# Altium schematic sheet 4_SurvBot_RCU_Bluetooth.SchDoc
size A2; SheetNumber: 5; SheetTotal: 8
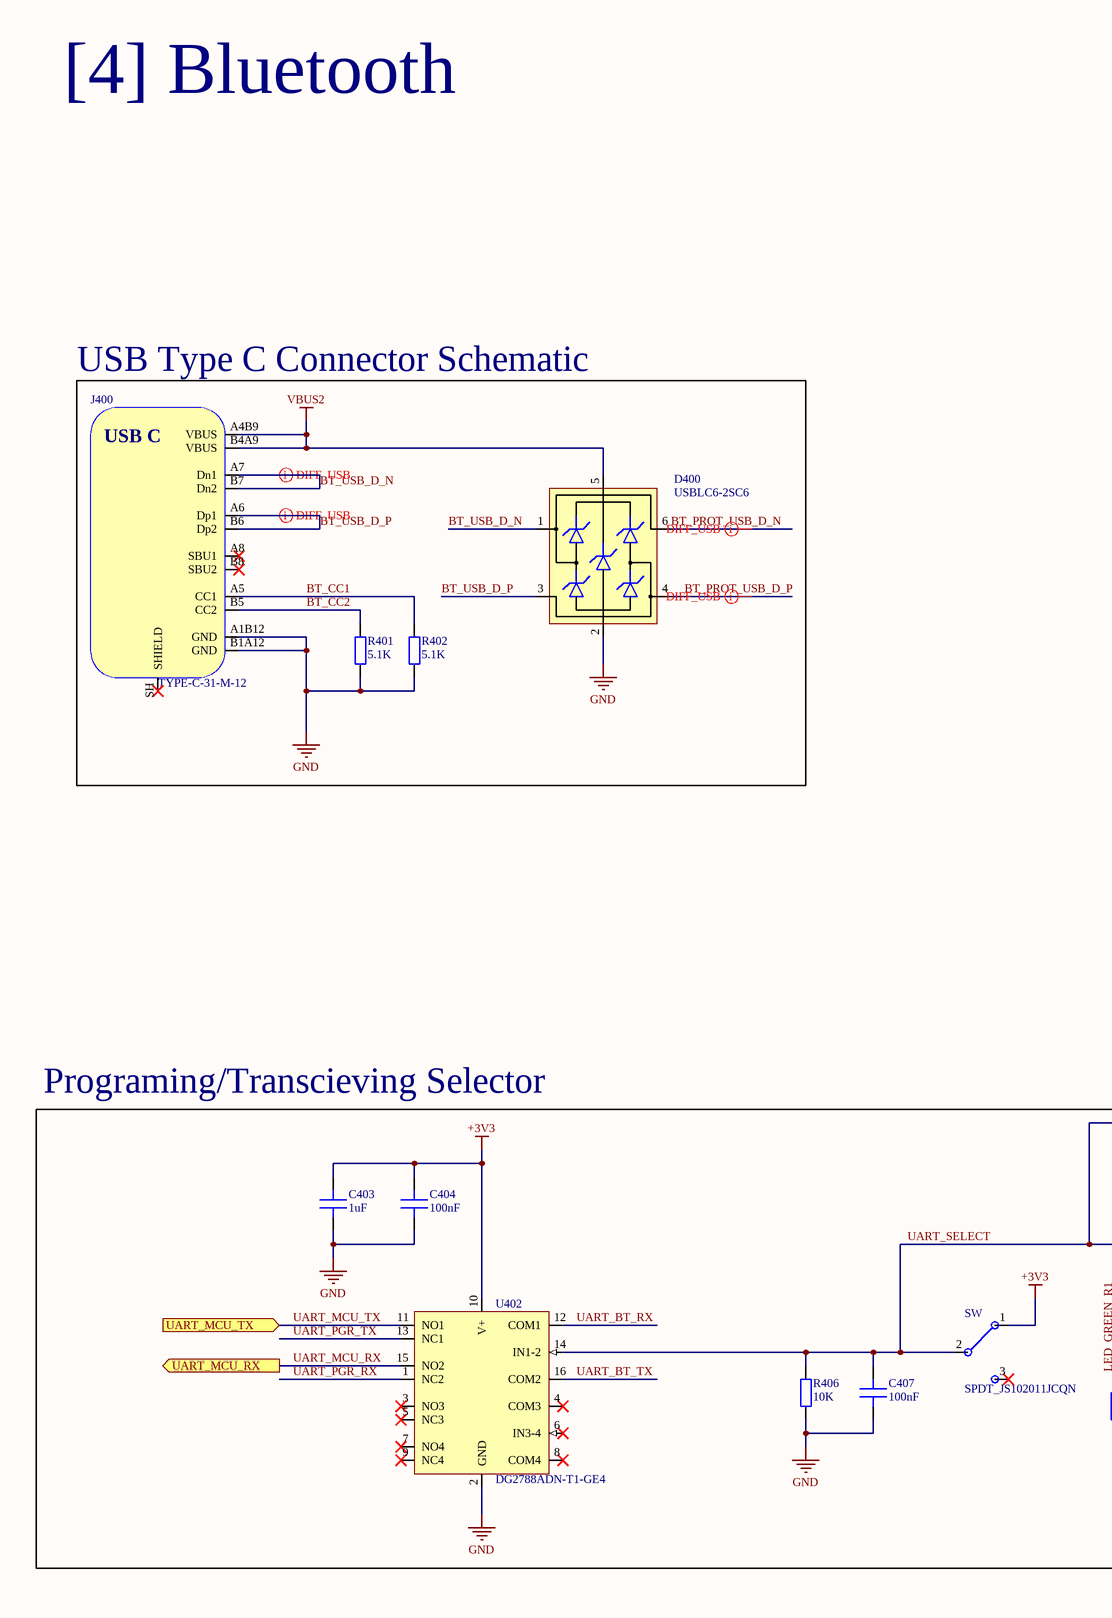
[diagram p0: 4_SurvBot_RCU_Bluetooth.SchDoc, left]
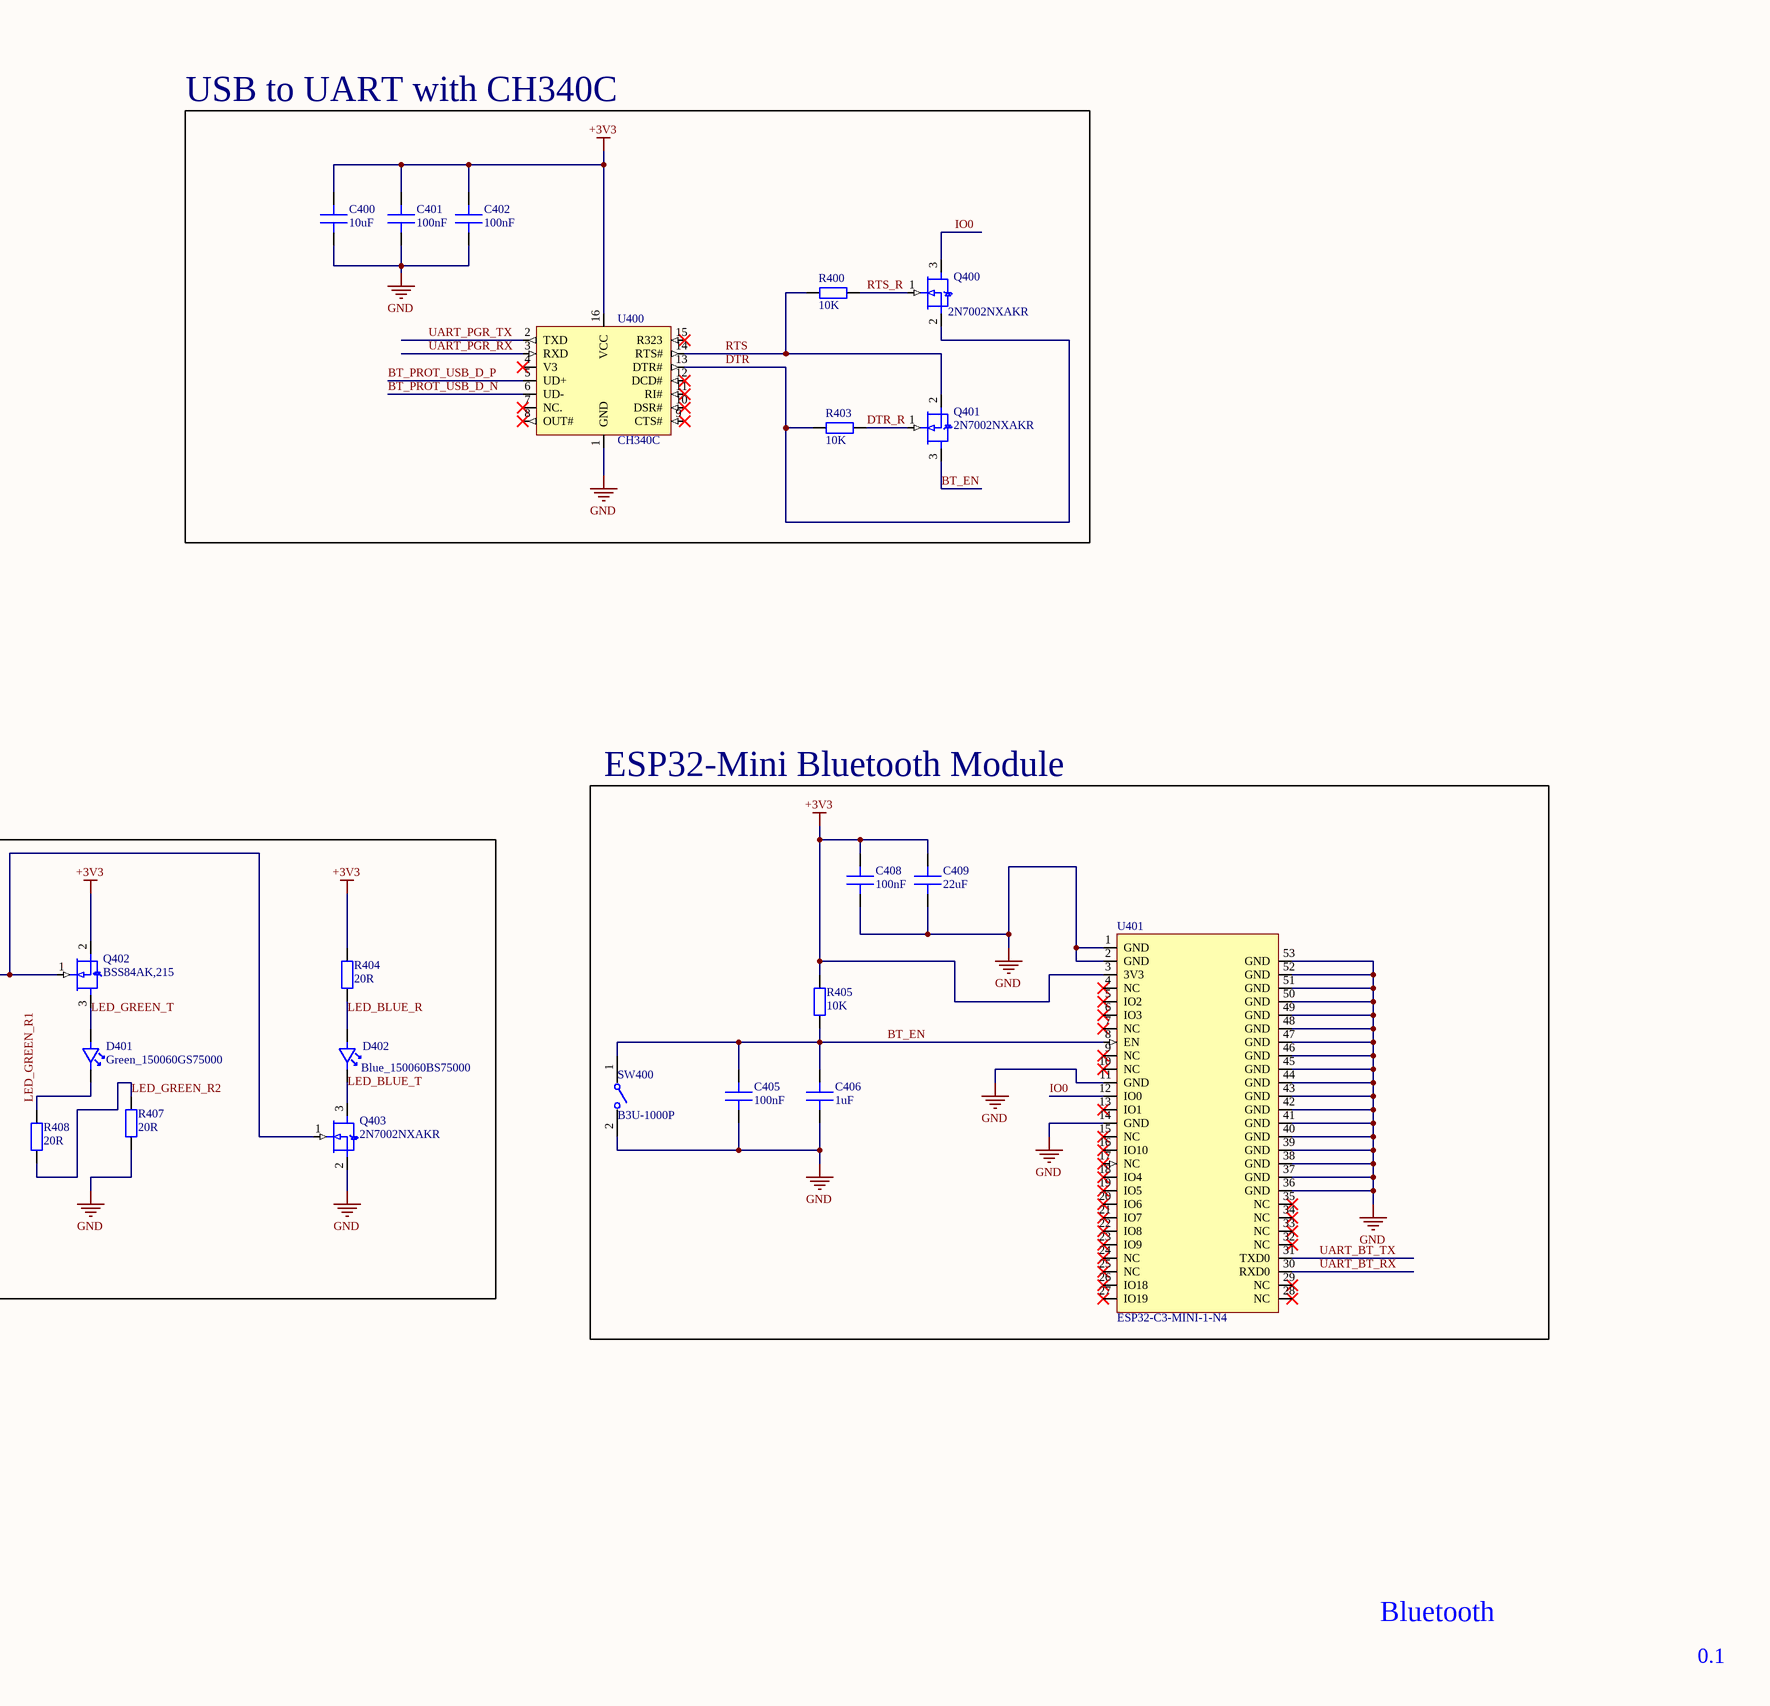
[diagram p1: 4_SurvBot_RCU_Bluetooth.SchDoc, right]

## Parts
C400  10uF  [CAP_0603]
C401  100nF  [CAP_0603]
C402  100nF  [CAP_0603]
C403  1uF  [CAP_0603]
C404  100nF  [CAP_0603]
C405  100nF  [CAP_0603]
C406  1uF  [CAP_0603]
C407  100nF  [CAP_0603]
C408  100nF  [CAP_0603]
C409  22uF  [CAP_0603]
D400  USBLC6-2SC6  [SOT-23-6]
D401  Green_150060GS75000  [LED_0603]
D402  Blue_150060BS75000  [LED_0603]
J400  TYPE-C-31-M-12  [USB4105-GF-A-060]
Q400  2N7002NXAKR  [SOT23-3]
Q401  2N7002NXAKR  [SOT23-3]
Q402  BSS84AK,215  [SOT23-3]
Q403  2N7002NXAKR  [SOT23-3]
R400  10K  [RES_0603]
R401  5.1K  [RES_0603]
R402  5.1K  [RES_0603]
R403  10K  [RES_0603]
R404  20R  [RES_0603]
R405  10K  [RES_0603]
R406  10K  [RES_0603]
R407  20R  [RES_0603]
R408  20R  [RES_0603]
SW  SPDT_JS102011JCQN  [SPDT_Slide-JS102011JCQN]
SW400  B3U-1000P  [FP-B3U-1000P-MFG]
U400  CH340C  [SOP-16]
U401  ESP32-C3-MINI-1-N4  [ESP32­C3­MINI­1]
U402  DG2788ADN-T1-GE4  [UQFN-16-DG2788ADN-T1-GE4]

## Blocks framed on the sheet
USB Type C Connector Schematic: D400 J400 R401 R402
USB to UART with CH340C: C400-C402 Q400 Q401 R400 R403 U400
ESP32-Mini Bluetooth Module: C405 C406 C408 C409 R405 SW400 U401
Programing/Transcieving Selector: C403 C404 C407 D401 D402 Q402 Q403 R404 R406-R408 SW U402

## Ports
UART_MCU_RX (out, see 0_SurvBot_RCU_Overview[1C], 2_SurvBot_RCU_MCU[4B]), UART_MCU_TX (in, see 0_SurvBot_RCU_Overview[1C], 2_SurvBot_RCU_MCU[4B])

## Nets
+3V3: C400.2 C401.2 C402.2 C403.2 C404.2 C408.2 C409.2 Q402.2(S) R404.1 R405.2 SW.1 U400.16(VCC) U401.3(3V3) U402.10(V+)
GND: C400.1 C401.1 C402.1 C403.1 C404.1 C405.1 C406.1 C407.1 C408.1 C409.1 D400.2(GND) J400.A1B12(GND) J400.B1A12(GND) Q403.2(S) R401.1 R402.1 R406.1 R407.1 SW400.2 U400.1(GND) U401.1(GND) U401.2(GND) U401.11(GND) U401.14(GND) U401.36(GND) U401.37(GND) U401.38(GND) U401.39(GND) U401.40(GND) U401.41(GND) U401.42(GND) U401.43(GND) U401.44(GND) U401.45(GND) U401.46(GND) U401.47(GND) U401.48(GND) U401.49(GND) U401.50(GND) U401.51(GND) U401.52(GND) U401.53(GND) U402.2(GND)
VBUS2: D400.5(VBUS) J400.A4B9(VBUS) J400.B4A9(VBUS)
BT_CC1: J400.A5(CC1) R402.2
BT_CC2: J400.B5(CC2) R401.2
BT_EN: C405.2 C406.2 Q401.3(D) R405.1 SW400.1 U401.8(EN)
BT_PROT_USB_D_N: D400.6(IO1) U400.6(UD-)
BT_PROT_USB_D_P: D400.4(IO2) U400.5(UD+)
BT_USB_D_N: D400.1(IO1) J400.A7(Dn1) J400.B7(Dn2)
BT_USB_D_P: D400.3(IO2) J400.A6(Dp1) J400.B6(Dp2)
DTR: Q400.2(S) R403.1 U400.13(DTR#)
DTR_R: Q401.1(G) R403.2
IO0: Q400.3(D) U401.12(IO0)
LED_BLUE_R: D402.2 R404.2
LED_BLUE_T: D402.1 Q403.3(D)
LED_GREEN_R1: D401.1 R408.1
LED_GREEN_R2: R407.2 R408.2
LED_GREEN_T: D401.2 Q402.3(D)
RTS: Q401.2(S) R400.1 U400.14(RTS#)
RTS_R: Q400.1(G) R400.2
UART_BT_RX: U401.30(RXD0) U402.12(COM1)
UART_BT_TX: U401.31(TXD0) U402.16(COM2)
UART_MCU_RX: U402.15(NO2) ; port UART_MCU_RX
UART_MCU_TX: U402.11(NO1) ; port UART_MCU_TX
UART_PGR_RX: U400.3(RXD) U402.1(NC2)
UART_PGR_TX: U400.2(TXD) U402.13(NC1)
UART_SELECT: C407.2 Q402.1(G) Q403.1(G) R406.2 SW.2 U402.14(IN1-2)

Not connected (* = marked no-connect by the designer): J400 A8(SBU1)* B8(SBU2)* SH(SHIELD)*; SW 3*; U400 4(V3)* 7(NC.)* 8(OUT#)* 9(CTS#)* 10(DSR#)* 11(RI#)* 12(DCD#)* 15(R323)*; U401 4(NC)* 5(IO2)* 6(IO3)* 7(NC)* 9(NC)* 10(NC)* 13(IO1)* 15(NC)* 16(IO10)* 17(NC)* 18(IO4)* 19(IO5)* 20(IO6)* 21(IO7)* 22(IO8)* 23(IO9)* 24(NC)* 25(NC)* 26(IO18)* 27(IO19)* 28(NC)* 29(NC)* 32(NC)* 33(NC)* 34(NC)* 35(NC)*; U402 3(NO3)* 4(COM3)* 5(NC3)* 6(IN3-4)* 7(NO4)* 8(COM4)* 9(NC4)*

## Layout directives
differential pair; differential pair class USB: BT_PROT_USB_D_N, BT_PROT_USB_D_P, BT_USB_D_N, BT_USB_D_P

## Notes on the sheet
- [4] Bluetooth
- Bluetooth
- 0.1
- (in symbol USB4105-GF-A-060_1) USB C

## Library data of the parts
C400 = CAP_10uF-10V-20%-0603: 10 µF ±20% 10V Ceramic Capacitor X5R 0603 (1608 Metric); Manufacturer: Murata Electronics; Manufacturer Part #: GRM188R61A106ME69D; Case/Package: 0603; Supplier: JLCPCB; Supplier Part #: C90053
C401 C402 C404 C405 C407 C408 = CAP_100nF-50V-10%-0603: 0.1 µF ±10% 50V Ceramic Capacitor X7R 0603 (1608 Metric); Manufacturer: KEMET; Manufacturer Part #: C0603C104K5RACAUTO; Case/Package: 0603; Supplier: JLCPCB; Supplier Part #: C129621
C403 C406 = CAP_1uF-16V-10%-0603: 1 µF ±10% 16V Ceramic Capacitor X7R 0603 (1608 Metric); Manufacturer: YAGEO; Manufacturer Part #: CC0603KRX7R7BB105; Case/Package: 0603; Supplier: JLCPCB; Supplier Part #: C106248
C409 = CAP_22uF-10V-20%-0603: 22 µF ±20% 10V Ceramic Capacitor X5R 0603 (1608 Metric); Manufacturer: Samsung Electro-Mechanics; Manufacturer Part #: CL10A226MP8NUNE; Case/Package: 0603; Supplier: JLCPCB; Supplier Part #: C86295
D400 = USBLC6-2SC6: Low-Capacitance ESD Protection USB; Manufacturer: STMicroelectronics; Manufacturer Part Number: USBLC6-2SC6; Distributor Link: https://www.mouser.de/ProductDetail/STMicroelectronics/USBLC6-2SC6?qs=po45yt2pPpu%2FhNIlwQdTlg%3D%3D
D401 = LED_Green-0603: Green 520nm LED Indication - Discrete 3.2V 0603 (1608 Metric); Manufacturer: Wurth Elektronik; Manufacturer Part #: 150060GS75000; Case/Package: 0603; Supplier: JLCPCB; Supplier Part #: C5252984
D402 = LED_Blue_0603: Blue 470nm LED Indication - Discrete 3.2V 0603 (1608 Metric); Manufacturer: Wurth Elektronik; Manufacturer Part #: 150060BS75000; Case/Package: 0603; Supplier: JLCPCB; Supplier Part #: C5197644
J400 = USB4105-GF-A-060_1: 5A 1 16P Female Type-C SMD USB Connectors ROHS; Manufacturer: Korean Hroparts Elec; Manufacturer Part Number: TYPE-C-31-M-12; Package: SMD; Supplier: JLCPCB; Supplier Part #: C165948
Q400 Q401 Q403 = MOSFET-N_60V-190mA-SOT23-3: N-Channel 60 V 190mA (Ta), 300mA (Tc) 265mW (Ta), 1.33W (Tc) Surface Mount TO-236AB; Manufacturer: Nexperia; Manufacturer Part #: 2N7002NXAKR; Case/Package: SOT23-3; Supplier: JLCPCB; Supplier Part #: C551416
Q402 = MOSFET-P_50V-180mA-SOT23-3: P-Channel 50 V 180mA (Ta) 350mW (Ta), 1.14W (Tc) Surface Mount TO-236AB; Manufacturer: Nexperia; Manufacturer Part #: BSS84AK,215; Case/Package: SOT-23-3; Supplier: JLCPCB; Supplier Part #: C127273
R400 R403 R405 R406 = RES_10K-100mW-1%-0603: 10 kOhms ±1% 0.1W, 1/10W Chip Resistor 0603 (1608 Metric) Moisture Resistant Thick Film; Manufacturer: YAGEO; Manufacturer Part #: RC0603FR-0710KL; Case/Package: 0603; Supplier: JLCPCB; Supplier Part #: C98220
R401 R402 = RES_5.1K-100mW-1%-0603: 5.1 kOhms ±1% 0.1W, 1/10W Chip Resistor 0603 (1608 Metric) Moisture Resistant Thick Film; Manufacturer: YAGEO; Manufacturer Part #: RC0603FR-075K1L; Case/Package: 0603; Supplier: JLCPCB; Supplier Part #: C105580
R404 R407 R408 = RES_20R-100mW-1%-0603: 20 Ohms ±1% 0.1W, 1/10W Chip Resistor 0603 (1608 Metric) Moisture Resistant Thick Film; Manufacturer: YAGEO; Manufacturer Part #: RC0603FR-0720RL; Case/Package: 0603; Supplier: JLCPCB; Supplier Part #: C125758
SW = SW_SPDT_JS102011JCQN: Slide Switch SPDT Surface Mount; Manufacturer: C&K; Manufacturer Part #: JS102011JCQN; Case/Package: SMD; Supplier: JLCPCB; Supplier Part #: C221659
SW400 = CMP-2100-03586-2: SWITCH TACTILE SPST-NO 0.05A 12V; Manufacturer: Omron Electronics; Contact Resistance: 100mR; Operating Force: 1.5N; Max Current Rating: 50mA; Switch Travel: 0.15mm; Actuator Type: Standard; Mechanical Life: 200000Cycles; Ratings: Dust Proof; Illumination Type: Non-Illuminated; Throw Configuration: SPST; Actuator Length: 0.4mm; Switch Function: Off-Mom; Height: 1.2mm; Width: 3mm; Weight: 0.000776oz; Contact Material: Silver; Max Voltage Rating (DC): 12V; Insulation Resistance: 100MR; Lead Free: Lead Free; Current Rating: 50mA; Termination: SMD/SMT; Length: 4mm; Voltage Rating (DC): 12V; Contact Current Rating: 50mA; Orientation: Straight; Depth: 2.5mm; Max Operating Temperature: 70°C; Packaging: Tape and Reel; Min Operating Temperature: -25°C; Package Quantity: 1; Mount: Surface Mount; Electrical Life: 200000Cycles; Manufacturer Part #: B3U-1000P; Case/Package: SMD, 2.5x3mm; Supplier: JLCPCB; Supplier Part #: C231329
U400 = CH340C-SOP-16_USB_Converter: 2Mbps Transceiver USB 2.0 SOP-16 USB Converters ROHS; Manufacturer: WCH(Jiangsu Qin Heng); Manufacturer Part #: CH340C; Case/Package: SOP-16; Supplier: JLCPCB; Supplier Part #: C7464026
U401 = MCU_ESP32-C3-MINI-1-N4: Bluetooth, WiFi 802.11b/g/n, Bluetooth v5.0 Transceiver Module 2.412GHz ~ 2.484GHz PCB Trace Surface Mount; Manufacturer: Espressif Systems; Manufacturer Part #: ESP32-C3-MINI-1-N4; Case/Package: 53-SMD Module; Supplier: JLCPCB; Supplier Part #: C2838502
U402 = IC_DG2788ADN-T1-GE4: 2 Circuit IC Switch 2:1 500mOhm 16-miniQFN (1.8x2.6); Manufacturer: Vishay Intertech; Manufacturer Part #: DG2788ADN-T1-GE4; Case/Package: UQFN-16(1.8x2.6); Supplier: JLCPCB; Supplier Part #: C222479